# EAGLE design RPi-ILDA-DAC (EAGLE 6.4)
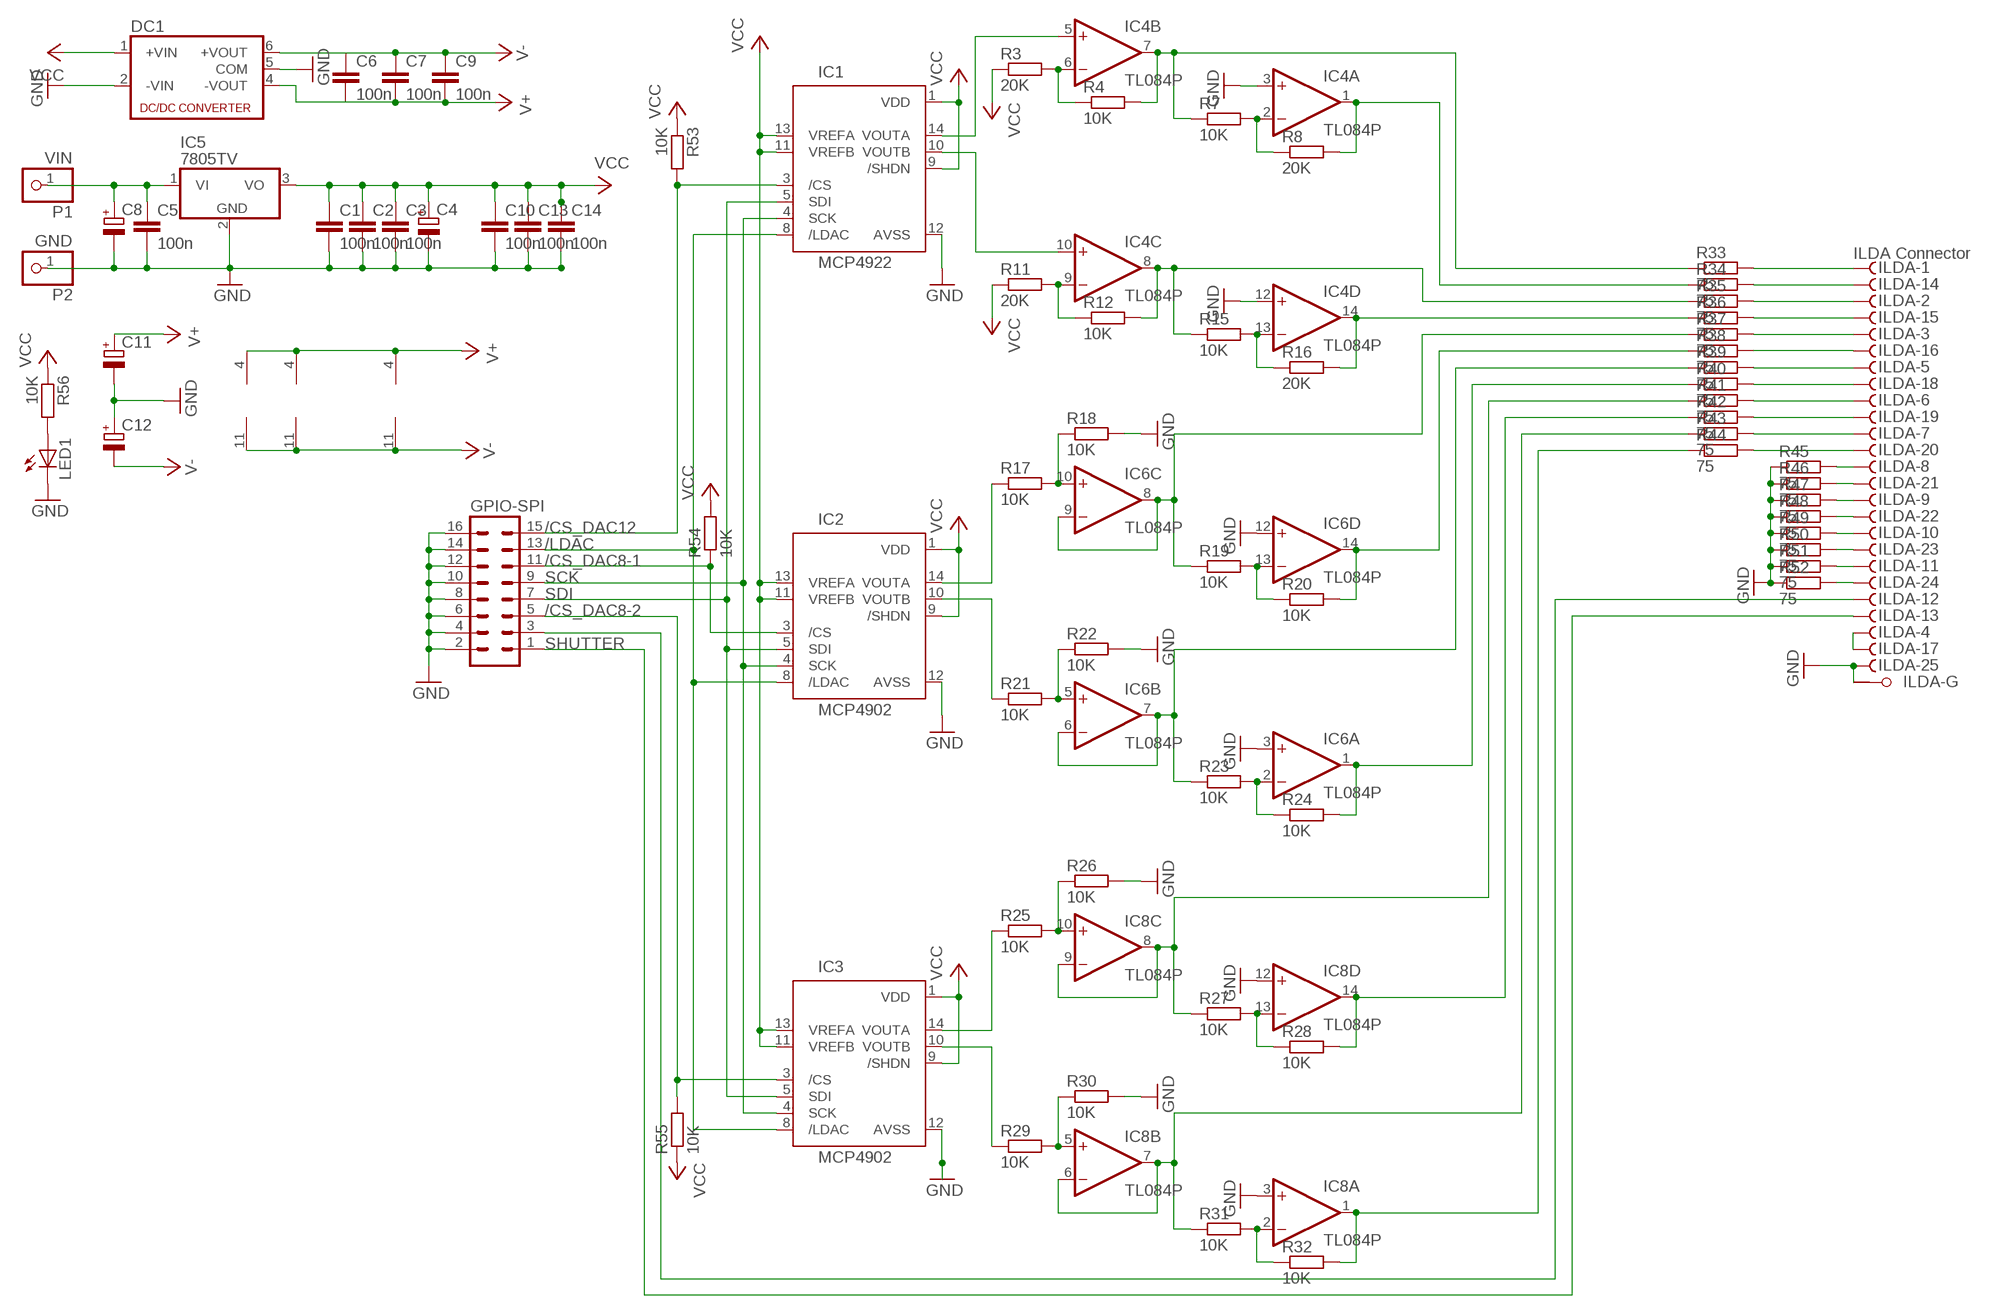
[diagram p0: schematic, sheet 1]

## Parts
C1  100n  C-EU050-024X044  [C050-024X044]
C2  100n  C-EU050-024X044  [C050-024X044]
C3  100n  C-EU050-024X044  [C050-024X044]
C4  CPOL-EUE5-6  [E5-6]
C5  100n  C-EU050-024X044  [C050-024X044]
C6  100n  C-EU050-024X044  [C050-024X044]
C7  100n  C-EU050-024X044  [C050-024X044]
C8  CPOL-EUE5-6  [E5-6]
C9  100n  C-EU050-024X044  [C050-024X044]
C10  100n  C-EU050-024X044  [C050-024X044]
C11  CPOL-EUE5-6  [E5-6]
C12  CPOL-EUE5-6  [E5-6]
C13  100n  C-EU050-024X044  [C050-024X044]
C14  100n  C-EU050-024X044  [C050-024X044]
DC1  NMA  [NMA]
GPIO-SPI  MA08-2  [MA08-2]
IC1  MCP4922  [DIL14]
IC2  MCP4902  MCP4922  [DIL14]
IC3  MCP4902  MCP4922  [DIL14]
IC4  TL084P  [DIL14]
IC5  7805TV  [TO220V]
IC6  TL084P  [DIL14]
IC8  TL084P  [DIL14]
ILDA  ILDA Connector  F25HPS  [F25HP]
LED1  LED3MM  [LED3MM]
P1  VIN  PINHD-1X1  [1X01]
P2  GND  PINHD-1X1  [1X01]
R3  20K  R-EU_0204/2V  [0204V]
R4  10K  R-EU_0204/2V  [0204V]
R7  10K  R-EU_0204/2V  [0204V]
R8  20K  R-EU_0204/2V  [0204V]
R11  20K  R-EU_0204/2V  [0204V]
R12  10K  R-EU_0204/2V  [0204V]
R15  10K  R-EU_0204/2V  [0204V]
R16  20K  R-EU_0204/2V  [0204V]
R17  10K  R-EU_0204/5  [0204/5]
R18  10K  R-EU_0204/2V  [0204V]
R19  10K  R-EU_0204/2V  [0204V]
R20  10K  R-EU_0204/2V  [0204V]
R21  10K  R-EU_0204/5  [0204/5]
R22  10K  R-EU_0204/2V  [0204V]
R23  10K  R-EU_0204/2V  [0204V]
R24  10K  R-EU_0204/2V  [0204V]
R25  10K  R-EU_0204/5  [0204/5]
R26  10K  R-EU_0204/2V  [0204V]
R27  10K  R-EU_0204/2V  [0204V]
R28  10K  R-EU_0204/2V  [0204V]
R29  10K  R-EU_0204/5  [0204/5]
R30  10K  R-EU_0204/2V  [0204V]
R31  10K  R-EU_0204/2V  [0204V]
R32  10K  R-EU_0204/2V  [0204V]
R33  75  R-EU_0204/7  [0204/7]
R34  75  R-EU_0204/7  [0204/7]
R35  75  R-EU_0204/7  [0204/7]
R36  75  R-EU_0204/7  [0204/7]
R37  75  R-EU_0204/7  [0204/7]
R38  75  R-EU_0204/7  [0204/7]
R39  75  R-EU_0204/7  [0204/7]
R40  75  R-EU_0204/7  [0204/7]
R41  75  R-EU_0204/7  [0204/7]
R42  75  R-EU_0204/7  [0204/7]
R43  75  R-EU_0204/7  [0204/7]
R44  75  R-EU_0204/7  [0204/7]
R45  75  R-EU_0204/2V  [0204V]
R46  75  R-EU_0204/2V  [0204V]
R47  75  R-EU_0204/2V  [0204V]
R48  75  R-EU_0204/2V  [0204V]
R49  75  R-EU_0204/2V  [0204V]
R50  75  R-EU_0204/2V  [0204V]
R51  75  R-EU_0204/2V  [0204V]
R52  75  R-EU_0204/2V  [0204V]
R53  10K  R-EU_0204/2V  [0204V]
R54  10K  R-EU_0204/2V  [0204V]
R55  10K  R-EU_0204/2V  [0204V]
R56  10K  R-EU_0204/7  [0204/7]

## Nets
/CS_DAC8-1: GPIO-SPI.11 IC2.3(/CS) R54.1
/CS_DAC8-2: GPIO-SPI.5 IC3.3(/CS) R55.2
/CS_DAC12: GPIO-SPI.15 IC1.3(/CS) R53.2
/LDAC: GPIO-SPI.13 IC1.8(/LDAC) IC2.8(/LDAC) IC3.8(/LDAC)
GND: C1.2 C2.2 C3.2 C4.- C5.2 C8.- C10.2 C11.- C12.+ C13.2 C14.2 DC1.2(-VIN) DC1.5(COM) GPIO-SPI.2 GPIO-SPI.4 GPIO-SPI.6 GPIO-SPI.8 GPIO-SPI.10 GPIO-SPI.12 GPIO-SPI.14 GPIO-SPI.16 IC1.12(AVSS) IC2.12(AVSS) IC3.12(AVSS) IC4.3(A:+IN) IC4.12(D:+IN) IC5.2(GND) IC6.3(A:+IN) IC6.12(D:+IN) IC8.3(A:+IN) IC8.12(D:+IN) ILDA.25(-25:F) ILDA.G1(-G:G1) LED1.K(C) P2.1 R18.2 R22.2 R26.2 R30.2 R45.1 R46.1 R47.1 R48.1 R49.1 R50.1 R51.1 R52.1
N$1: LED1.A R56.2
N$2: ILDA.3(-3:F) R37.2
N$3: IC4.7(B:OUT) R4.2 R7.1 R33.1
N$4: GPIO-SPI.3 ILDA.12(-12:F)
N$5: IC4.13(D:-IN) R15.2 R16.1
N$6: IC3.14(VOUTA) R25.1
N$7: IC6.1(A:OUT) R24.2 R40.1
N$8: IC6.2(A:-IN) R23.2 R24.1
N$9: IC6.5(B:+IN) R21.2 R22.1
N$10: ILDA.4(-4:F) ILDA.17(-17:F)
N$11: IC6.6(B:-IN) IC6.7(B:OUT) R23.1 R39.1
N$12: C5.1 C8.+ IC5.1(VI) P1.1
N$15: ILDA.5(-5:F) R39.2
N$16: IC1.14(VOUTA) IC4.5(B:+IN)
N$17: IC1.10(VOUTB) IC4.10(C:+IN)
N$18: ILDA.18(-18:F) R40.2
N$20: IC6.14(D:OUT) R20.2 R38.1
N$21: IC4.2(A:-IN) R7.2 R8.1
N$22: IC6.13(D:-IN) R19.2 R20.1
N$23: IC8.14(D:OUT) R28.2 R42.1
N$24: IC6.10(C:+IN) R17.2 R18.1
N$25: IC6.8(C:OUT) IC6.9(C:-IN) R19.1 R37.1
N$27: IC8.13(D:-IN) R27.2 R28.1
N$28: IC8.10(C:+IN) R25.2 R26.1
N$30: IC8.8(C:OUT) IC8.9(C:-IN) R27.1 R41.1
N$33: ILDA.8(-8:F) R45.2
N$34: ILDA.6(-6:F) R41.2
N$35: ILDA.16(-16:F) R38.2
N$37: IC4.14(D:OUT) R16.2 R36.1
N$38: ILDA.19(-19:F) R42.2
N$40: IC8.1(A:OUT) R32.2 R44.1
N$41: IC8.2(A:-IN) R31.2 R32.1
N$42: IC8.5(B:+IN) R29.2 R30.1
N$44: IC8.6(B:-IN) IC8.7(B:OUT) R31.1 R43.1
N$45: IC3.10(VOUTB) R29.1
N$47: IC4.1(A:OUT) R8.2 R34.1
N$49: IC4.8(C:OUT) R12.2 R15.1 R35.1
N$50: IC4.6(B:-IN) R3.2 R4.1
N$51: IC4.9(C:-IN) R11.2 R12.1
N$52: ILDA.7(-7:F) R43.2
N$53: ILDA.20(-20:F) R44.2
N$54: ILDA.21(-21:F) R46.2
N$55: ILDA.9(-9:F) R47.2
N$56: ILDA.22(-22:F) R48.2
N$57: ILDA.10(-10:F) R49.2
N$58: ILDA.23(-23:F) R50.2
N$59: IC2.14(VOUTA) R17.1
N$60: ILDA.11(-11:F) R51.2
N$61: ILDA.24(-24:F) R52.2
N$62: IC2.10(VOUTB) R21.1
N$91: ILDA.1(-1:F) R33.2
N$92: ILDA.14(-14:F) R34.2
N$93: ILDA.15(-15:F) R36.2
N$94: ILDA.2(-2:F) R35.2
SCK: GPIO-SPI.9 IC1.4(SCK) IC2.4(SCK) IC3.4(SCK)
SDI: GPIO-SPI.7 IC1.5(SDI) IC2.5(SDI) IC3.5(SDI)
SHUTTER: GPIO-SPI.1 ILDA.13(-13:F)
V+: C6.2 C7.2 C9.2 C11.+ DC1.4(-VOUT) IC4.4(P:V+) IC6.4(P:V+) IC8.4(P:V+)
V-: C6.1 C7.1 C9.1 C12.- DC1.6(+VOUT) IC4.11(P:V-) IC6.11(P:V-) IC8.11(P:V-)
VCC: C1.1 C2.1 C3.1 C4.+ C10.1 C13.1 C14.1 DC1.1(+VIN) IC1.1(VDD) IC1.9(/SHDN) IC1.11(VREFB) IC1.13(VREFA) IC2.1(VDD) IC2.9(/SHDN) IC2.11(VREFB) IC2.13(VREFA) IC3.1(VDD) IC3.9(/SHDN) IC3.11(VREFB) IC3.13(VREFA) IC5.3(VO) R3.1 R11.1 R53.1 R54.2 R55.1 R56.1
Unconnected: ILDA.G2(-G:G2)

## Library data of the parts
C1-C3 C5-C7 C9 C10 C13 C14 = rcl:C-EU: CAPACITOR, European symbol
C4 C8 C11 C12 = rcl:CPOL-EU: POLARIZED CAPACITOR, European symbol
DC1 = dc-dc-converter:NMA: DC-DC CONVERTER; MF: C & D TECHNOLOGIES, INC; MPN: NMA0515SC; OC_FARNELL: 1021434; OC_NEWARK: 61K3064
GPIO-SPI = con-lstb:MA08-2: PIN HEADER; OC_FARNELL: unknown; OC_NEWARK: unknown
IC1-IC3 = Peripherals:MCP4922: 12-Bit DAC with SPI Interface
IC4 IC6 IC8 = linear:TL084: OP AMP
IC5 = linear:78*: Positive VOLTAGE REGULATOR Source: http://cache.national.com/ds/LM/LM78L05.pdf http://www.fairchildsemi.com/ds/LM/LM7805.pdf
ILDA = con-subd:F25HPS: SUB-D; OC_FARNELL: unknown; OC_NEWARK: unknown
LED1 = led:LED: LED OSRAM: - CHIPLED LG R971, LG N971, LY N971, LG Q971, LY Q971, LO R971, LY R971 LH N974, LH R974 LS Q976, LO Q976, LY Q976 LO Q996 - Hyper CHIPLED LW Q18S LB Q993, LB Q99A, LB R99A - SideLED LS A670, LO A670, LY A670, LG A670, LP A670 LB A673, LV A673, LT A673, LW A673 LH A674 LY A675 LS A676, LA A676, LO A676, LY A676, LW A676 LS A679, LY A679, LG A679 - Hyper Micro SIDELED® LS Y876, LA Y876, LO Y876, LY Y876 LT Y87S - SmartLED LW L88C, LW L88S LB L89C, LB L89S, LG L890 LS L89K, LO L89K, LY L89K LS L896, LA L896, LO L896, LY L896 - TOPLED LS T670, LO T670, LY T670, LG T670, LP T670 LSG T670, LSP T670, LSY T670, LOP T670, LYG T670 LG T671, LOG T671, LSG T671 LB T673, LV T673, LT T673, LW T673 LH T674 LS T676, LA T676, LO T676, LY T676, LB T676, LH T676, LSB T676, LW T676 LB T67C, LV T67C, LT T67C, LS T67K, LO T67K, LY T67K, LW E67C LS E67B, LA E67B, LO E67B, LY E67B, LB E67C, LV E67C, LT E67C LW T67C LS T679, LY T679, LG T679 LS T770, LO T770, LY T770, LG T770, LP T770 LB T773, LV T773, LT T773, LW T773 LH T774 LS E675, LA E675, LY E675, LS T675 LS T776, LA T776, LO T776, LY T776, LB T776 LHGB T686 LT T68C, LB T68C - Hyper Mini TOPLED® LB M676 - Mini TOPLED Santana® LG M470 LS M47K, LO M47K, LY M47K Source: http://www.osram.convergy.de LUXEON: - LUMILED® LXK2-PW12-R00, LXK2-PW12-S00, LXK2-PW14-U00, LXK2-PW14-V00 LXK2-PM12-R00, LXK2-PM12-S00, LXK2-PM14-U00 LXK2-PE12-Q00, LXK2-PE12-R00, LXK2-PE12-S00, LXK2-PE14-T00, LXK2-PE14-U00 LXK2-PB12-K00, LXK2-PB12-L00, LXK2-PB12-M00, LXK2-PB14-N00, LXK2-PB14-P00, LXK2-PB14-Q00 LXK2-PR12-L00, LXK2-PR12-M00, LXK2-PR14-Q00, LXK2-PR14-R00 LXK2-PD12-Q00, LXK2-PD12-R00, LXK2-PD12-S00 LXK2-PH12-R00, LXK2-PH12-S00 LXK2-PL12-P00, LXK2-PL12-Q00, LXK2-PL12-R00 Source: www.luxeon.com KINGBRIGHT: KA-3528ASYC Source: www.kingbright.com
P1 P2 = pinhead:PINHD-1X1: PIN HEADER
R3 R4 R7 R8 R11 R12 R15-R56 = resistor:R-EU_: RESISTOR, European symbol

## Board
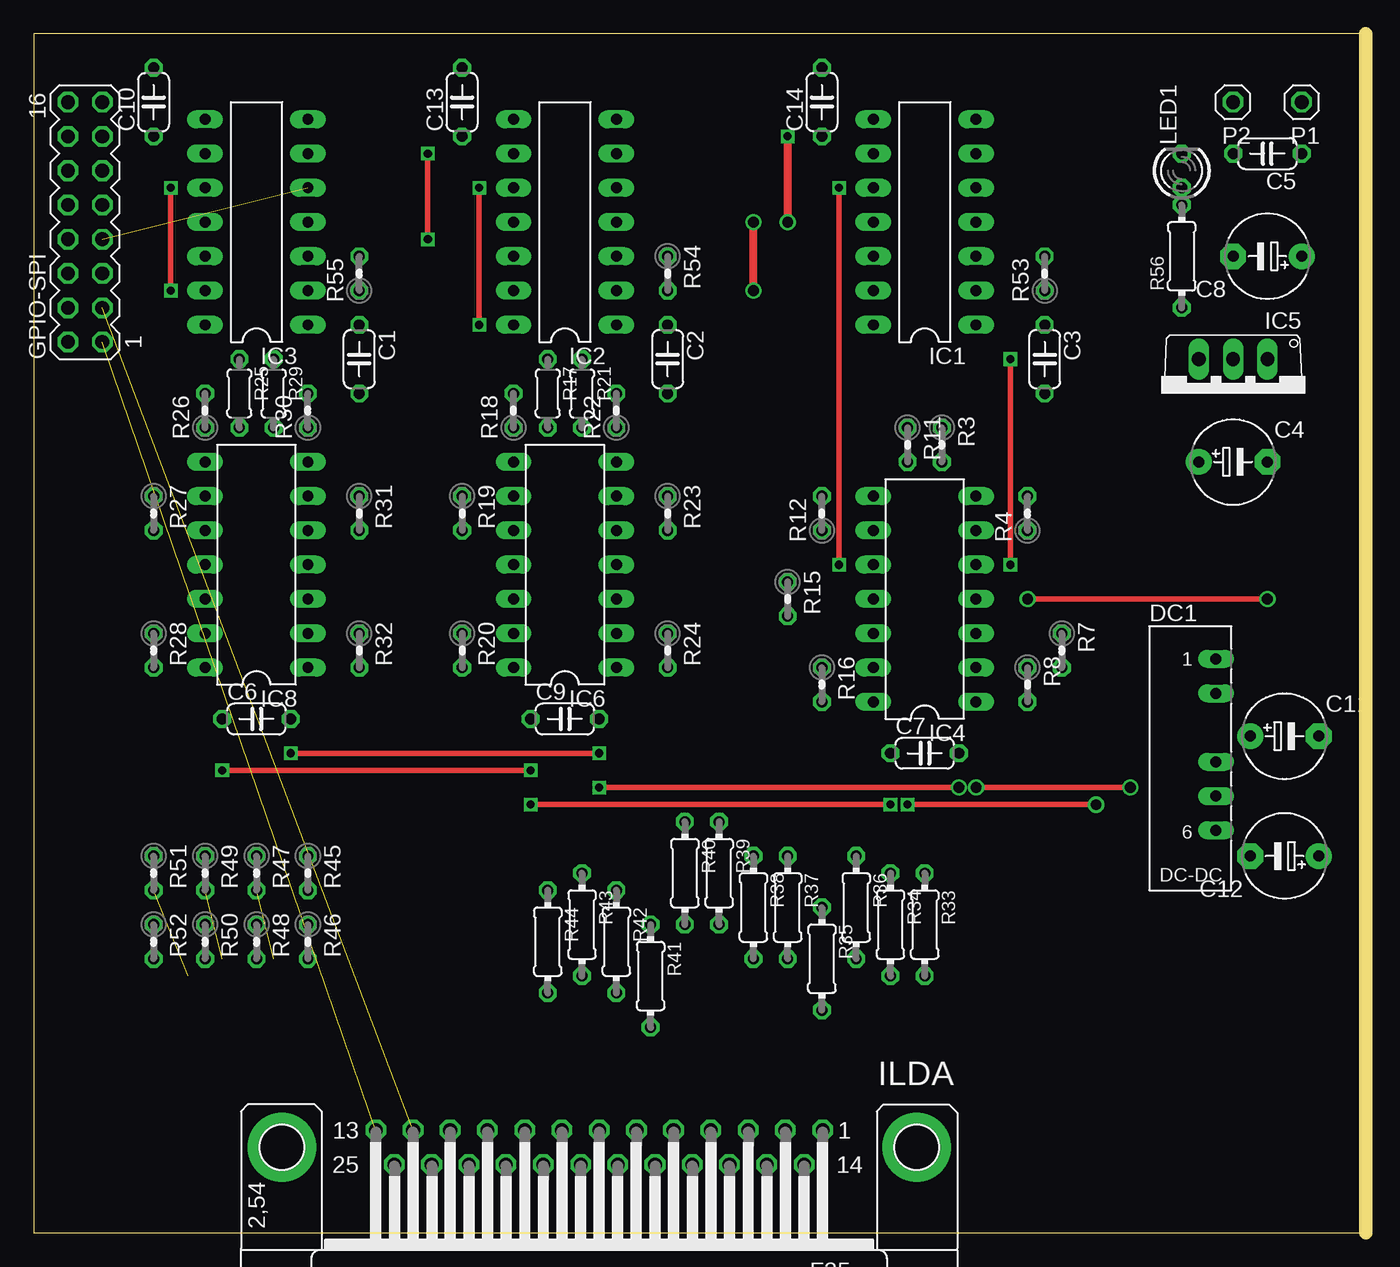
[diagram p1: board, top side]
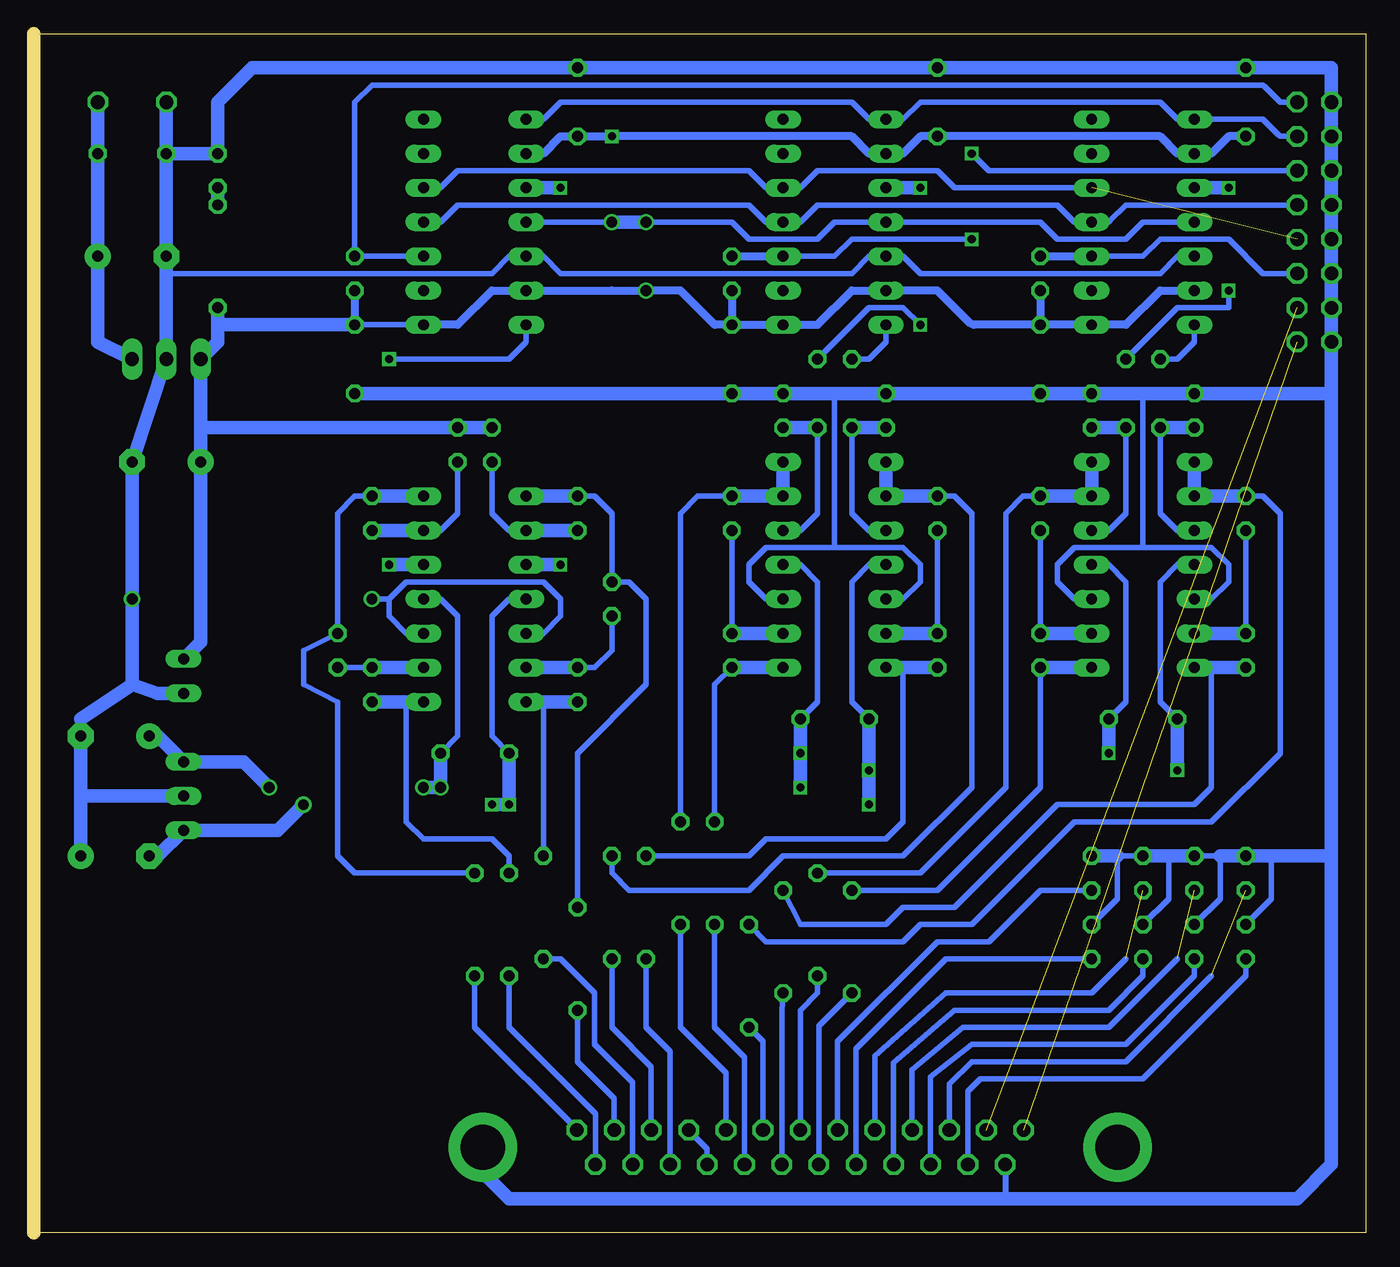
[diagram p2: board, bottom side, seen from below]

Size 98.73 x 88.89 mm. Coordinates in mm from the lower left corner, seen from the top.
Outline: 0,0 98.73,0 98.73,88.89 0,88.89 0,0
Copper layers (1*16): Top 0.035mm / dielectric 1.5mm / Bottom 0.035mm
Design rules "default": minimum track width 10mil, minimum drill 24mil, track to track 8mil, track to pad 8mil, pad to pad 8mil, via to via 8mil, smd to smd 8mil, copper to edge 40mil, drill to drill 8mil, minimum pad ring 10mil, minimum via ring 8mil, stop-mask expansion 4mil, vias tented up to drill 0mil, thermal gap 10mil

### Footprints (pad centres in the part's own frame; a part is rotated, then mirrored left to right if it is on the bottom)
C050-024X044 = drill 0.813 octagon: 1 -2.54,0; 2 2.54,0
E5-6 = drill 0.813 pad 1.905: + -2.54,0 | drill 0.813 pad 1.905 octagon: - 2.54,0
NMA = drill 0.813 long: 1 0,6.35; 2 0,3.81; 4 0,-1.27; 5 0,-3.81; 6 0,-6.35
MA08-2 = drill 1.016 octagon: 1 -8.89,-1.27; 2 -8.89,1.27; 3 -6.35,-1.27; 4 -6.35,1.27; 5 -3.81,-1.27; 6 -3.81,1.27; 7 -1.27,-1.27; 8 -1.27,1.27; 9 1.27,-1.27; 10 1.27,1.27; 11 3.81,-1.27; 12 3.81,1.27; 13 6.35,-1.27; 14 6.35,1.27; 15 8.89,-1.27; 16 8.89,1.27
DIL14 = drill 0.813 long: 1 -7.62,-3.81; 2 -5.08,-3.81; 3 -2.54,-3.81; 4 0,-3.81; 5 2.54,-3.81; 6 5.08,-3.81; 7 7.62,-3.81; 8 7.62,3.81; 9 5.08,3.81; 10 2.54,3.81; 11 0,3.81; 12 -2.54,3.81; 13 -5.08,3.81; 14 -7.62,3.81
TO220V = drill 1.016 long: 1 -2.54,-2.54; 2 0,-2.54; 3 2.54,-2.54
F25HP = drill 1.016 octagon: 1 -16.561,-1.27; 2 -13.792,-1.27; 3 -11.049,-1.27; 4 -8.28,-1.27; 5 -5.512,-1.27; 6 -2.769,-1.27; 7 0,-1.27; 8 2.769,-1.27; 9 5.512,-1.27; 10 8.28,-1.27; 11 11.049,-1.27; 12 13.792,-1.27; 13 16.561,-1.27; 14 -15.189,1.27; 15 -12.421,1.27; 16 -9.652,1.27; 17 -6.909,1.27; 18 -4.14,1.27; 19 -1.372,1.27; 20 1.372,1.27; 21 4.14,1.27; 22 6.909,1.27; 23 9.652,1.27; 24 12.421,1.27; 25 15.189,1.27 | drill 3.302 pad 5.08: G1 -23.52,0; G2 23.52,0
LED3MM = drill 0.813 octagon: A -1.27,0; K 1.27,0
1X01 = drill 1.016 octagon: 1 0,0
0204V = drill 0.813 octagon: 1 -1.27,0; 2 1.27,0
0204/5 = drill 0.813 octagon: 1 -2.54,0; 2 2.54,0
0204/7 = drill 0.813 octagon: 1 -3.81,0; 2 3.81,0

### Placement (x,y rotation side)
C1  24.13,64.77 270 top
C2  46.99,64.77 270 top
C3  74.93,64.77 270 top
C4  88.9,57.15 0 top
C5  91.44,80.01 180 top
C6  16.51,38.1 0 top
C7  66.04,35.56 0 top
C8  91.44,72.39 180 top
C9  39.37,38.1 0 top
C10  8.89,83.82 90 top
C11  92.71,36.83 0 top
C12  92.71,27.94 180 top
C13  31.75,83.82 90 top
C14  58.42,83.82 90 top
DC1  87.63,36.2 0 top
GPIO-SPI  3.81,74.93 90 top
IC1  66.04,74.93 90 top
IC2  39.37,74.93 90 top
IC3  16.51,74.93 90 top
IC4  66.04,46.99 90 top
IC5  88.9,62.23 180 top
IC6  39.37,49.53 90 top
IC8  16.51,49.53 90 top
ILDA  41.91,6.35 180 top
LED1  85.09,78.74 90 top
P1  93.98,83.82 180 top
P2  88.9,83.82 180 top
R3  67.31,58.42 270 top
R4  73.66,53.34 90 top
R7  76.2,43.18 270 top
R8  73.66,40.64 270 top
R11  64.77,58.42 270 top
R12  58.42,53.34 90 top
R15  55.88,46.99 270 top
R16  58.42,40.64 270 top
R17  38.1,62.23 270 top
R18  35.56,60.96 90 top
R19  31.75,53.34 270 top
R20  31.75,43.18 270 top
R21  40.64,62.23 270 top
R22  43.18,60.96 90 top
R23  46.99,53.34 270 top
R24  46.99,43.18 270 top
R25  15.24,62.23 270 top
R26  12.7,60.96 90 top
R27  8.89,53.34 270 top
R28  8.89,43.18 270 top
R29  17.78,62.23 270 top
R30  20.32,60.96 90 top
R31  24.13,53.34 270 top
R32  24.13,43.18 270 top
R33  66.04,22.86 270 top
R34  63.5,22.86 270 top
R35  58.42,20.32 270 top
R36  60.96,24.13 270 top
R37  55.88,24.13 270 top
R38  53.34,24.13 270 top
R39  50.8,26.67 270 top
R40  48.26,26.67 270 top
R41  45.72,19.05 270 top
R42  43.18,21.59 270 top
R43  40.64,22.86 270 top
R44  38.1,21.59 270 top
R45  20.32,26.67 270 top
R46  20.32,21.59 270 top
R47  16.51,26.67 270 top
R48  16.51,21.59 270 top
R49  12.7,26.67 270 top
R50  12.7,21.59 270 top
R51  8.89,26.67 270 top
R52  8.89,21.59 270 top
R53  74.93,71.12 90 top
R54  46.99,71.12 270 top
R55  24.13,71.12 90 top
R56  85.09,72.39 90 top

### Tracks (layer width: path | path; a pad name or v marks a point on that pad's centre or on a via)
/CS_DAC8-1  (via drill 0.6)
  Top 0.406: v29.21,73.66 v29.21,80.01
  Bottom 0.406: v29.21,80.01 27.94,78.74 GPIO-SPI.11 | IC2.3 39.37,72.39 38.1,73.66 v29.21,73.66
  Bottom 0.61: R54.1 IC2.3
/CS_DAC8-2
  Bottom 0.406: IC3.3 16.51,72.39 15.24,73.66 10.16,73.66 7.62,71.12 GPIO-SPI.5
  Bottom 0.61: R55.2 IC3.3
/CS_DAC12
  Bottom 0.406: 7.75,85.09 arc45 7.53,85 | 7.53,85 6.35,83.82 GPIO-SPI.15 | 7.75,85.09 73.66,85.09 74.93,83.82 R53.2 IC1.3 | 7.75,85.09 arc45 7.53,85
/LDAC
  Bottom 0.406: GPIO-SPI.13 6.22,81.28 arc45 6.44,81.37 7.62,82.55 IC3.8 13.97,82.55 15.24,83.82 33.02,83.82 34.29,82.55 IC2.8 36.83,82.55 38.1,83.82 59.69,83.82 60.96,82.55 IC1.8
GND  (via drill 0.8)
  Top 0.406: v73.66,46.99 v91.44,46.99
  Bottom 0.406: IC8.12 11.43,46.99 10.16,48.26 10.16,49.53 11.43,50.8 16.51,50.8 | IC8.3 21.59,46.99 22.86,48.26 22.86,49.53 21.59,50.8 16.51,50.8 | IC4.3 71.12,44.45 72.39,45.72 72.39,46.99 | IC4.12 60.96,44.45 59.69,45.72 59.69,46.99 60.96,48.26 71.12,48.26 72.39,46.99 | IC6.3 44.45,46.99 45.72,48.26 45.72,49.53 44.45,50.8 39.37,50.8 | IC6.12 34.29,46.99 33.02,48.26 33.02,49.53 34.29,50.8 39.37,50.8 | 39.37,50.8 39.37,62.23 | 16.51,50.8 16.51,62.23 | R47.1 18.41,27.94 18.41,24.77 R46.1 | R49.1 10.79,27.94 10.79,24.77 R50.1 | R48.1 14.61,24.77 14.61,27.94 | R52.1 6.98,24.77 6.98,27.94 | C5.2 88.9,71.12 64.77,71.12 63.5,72.39 IC1.12 60.96,72.39 59.69,71.12 38.1,71.12 36.83,72.39 IC2.12 34.29,72.39 33.02,71.12 15.24,71.12 13.97,72.39 IC3.12 | LED1.K 85.09,83.82 82.55,86.36 C10.2 | 94.61,32.38 95.25,33.02 | C11.- 95.25,38.1 | 72.39,46.99 v73.66,46.99 | 26.67,2.54 26.67,5.03 ILDA.25 26.72,2.59 26.67,2.54
  Bottom 1.016: C5.2 LED1.K 85.09,83.69 arc45 85,83.91 82.55,86.36 C14.2 C13.2 C10.2 2.54,86.36 GPIO-SPI.16 GPIO-SPI.14 GPIO-SPI.12 GPIO-SPI.10 GPIO-SPI.8 GPIO-SPI.6 GPIO-SPI.4 GPIO-SPI.2 2.54,62.23 | C5.2 P2.1 | C5.2 C8.- 88.9,71.12 IC5.2 C4.- v91.44,46.99 91.44,40.64 | R18.2 39.37,62.23 R22.2 C2.2 C3.2 | R30.2 C1.2 R18.2 | R30.2 16.51,62.23 R26.2 2.54,62.23 | R18.2 R30.2 | ILDA.G1 65.43,4.47 63.5,2.54 26.67,2.54 5.08,2.54 2.54,5.08 2.54,27.94 | 2.54,27.94 2.54,62.23 | R45.1 18.41,27.94 | R47.1 14.61,27.94 R49.1 | 10.79,27.94 R51.1 6.98,27.94 2.54,27.94 | C12.+ 95.25,33.02 C11.- | DC1.5 94.61,32.38 | 91.44,40.64 89.53,40 DC1.2 | 95.25,38.1 91.44,40.64
N$1
  Bottom 1.016: R56.2 LED1.A
N$2
  Bottom 0.406: ILDA.3 52.96,12.32 55.88,15.24 R37.2
N$3
  Bottom 0.406: R4.2 74.93,54.61 76.2,53.34 R7.1 78.74,43.18 78.74,40.64 76.2,39.37 76.2,27.94 74.93,26.67 R33.1
  Bottom 1.016: IC4.7 R4.2
N$4  (1 unrouted)
N$5
  Bottom 0.406: R16.1 57.15,41.91 55.88,43.18 R15.2
  Bottom 1.016: R16.1 IC4.13
N$6
  Bottom 0.406: IC3.14 12.7,66.04 13.97,64.77 R25.1
N$7
  Bottom 0.406: R40.1 48.26,40.64 R24.2
  Bottom 1.016: R24.2 IC6.1
N$8
  Bottom 0.406: R23.2 R24.1
  Bottom 1.016: IC6.2 R24.1
N$9
  Bottom 0.406: IC6.5 41.91,52.07 40.64,53.34 R21.2
  Bottom 1.016: R21.2 R22.1
N$10
  Bottom 0.406: ILDA.17 48.82,6.25 ILDA.4
N$11
  Bottom 0.406: R39.1 50.8,53.34 49.53,54.61 R23.1
  Bottom 1.016: IC6.7 IC6.6 R23.1
N$12
  Bottom 1.016: IC5.1 93.98,66.04 C8.+ C5.1 P1.1
N$15
  Bottom 0.406: ILDA.5 47.42,11.86 50.8,15.24 R39.2
N$16  (via drill 0.6)
  Top 0.406: v72.39,64.77 v72.39,49.53
  Bottom 0.406: IC1.14 62.23,66.17 arc45 62.32,65.95 63.5,64.77 v72.39,64.77
  Bottom 1.016: v72.39,49.53 IC4.5
N$17  (via drill 0.6)
  Top 0.406: v59.69,49.53 v59.69,77.47
  Bottom 1.016: IC4.10 v59.69,49.53 | v59.69,77.47 IC1.10
N$18
  Bottom 0.406: ILDA.18 46.05,13.03 48.26,15.24 R40.2
N$20
  Bottom 0.406: IC6.14 34.29,41.91 34.29,30.48 35.56,29.21 44.45,29.21 45.72,27.94 R38.1
  Bottom 1.016: 34.29,41.91 R20.2
N$21
  Bottom 0.406: R8.1 R7.2
  Bottom 1.016: IC4.2 R8.1
N$22
  Bottom 0.406: R20.1 R19.2
  Bottom 1.016: IC6.13 R20.1
N$23
  Bottom 0.406: IC8.14 11.43,41.91 11.43,33.02 12.7,31.75 22.86,31.75 30.48,24.13 34.29,24.13 35.56,22.86 41.91,22.86 R42.1
  Bottom 1.016: 11.43,41.91 R28.2
N$24
  Bottom 0.406: IC6.10 36.83,52.07 38.1,53.34 R17.2
  Bottom 1.016: R17.2 R18.1
N$25
  Bottom 0.406: R37.1 55.88,26.67 54.61,25.4 45.72,25.4 43.18,27.94 34.29,27.94 29.21,33.02 29.21,53.34 30.48,54.61 R19.1
  Bottom 1.016: IC6.8 IC6.9 R19.1
N$27
  Bottom 0.406: R28.1 R27.2
  Bottom 1.016: R28.1 IC8.13
N$28
  Bottom 0.406: R25.2 15.24,53.34 13.97,52.07 IC8.10
  Bottom 1.016: R25.2 R26.1
N$30
  Bottom 0.406: R27.1 7.62,54.61 6.35,53.34 6.35,35.56 11.43,30.48 21.59,30.48 29.21,22.86 33.02,22.86 34.29,21.59 44.45,21.59 R41.1
  Bottom 1.016: IC8.8 IC8.9 R27.1
N$33
  Bottom 0.406: ILDA.8 39.14,14.2 31.75,21.59 27.94,21.59 24.13,25.4 R45.2
N$34
  Bottom 0.406: ILDA.6 44.68,14.2 R41.2
N$35
  Bottom 0.406: ILDA.16 51.56,13.46 53.34,15.24 R38.2
N$37
  Bottom 0.406: IC4.14 60.96,39.37 R36.1
  Bottom 1.016: 60.96,39.37 R16.2
N$38
  Bottom 0.406: ILDA.19 43.28,16.41 R42.2
N$40
  Bottom 0.406: R44.1 31.75,25.4 24.13,33.02 R32.2
  Bottom 1.016: IC8.1 R32.2
N$41
  Bottom 0.406: R32.1 R31.2
  Bottom 1.016: R32.1 IC8.2
N$42
  Bottom 0.406: R29.2 17.78,53.34 19.05,52.07 IC8.5
  Bottom 1.016: R29.2 R30.1
N$44
  Bottom 0.406: R31.1 25.4,54.61 26.67,53.34 26.67,33.02 33.02,26.67 R43.1
  Bottom 1.016: IC8.7 IC8.6 R31.1
N$45  (via drill 0.6)
  Top 0.406: v10.16,69.85 v10.16,77.47
  Bottom 0.406: R29.1 13.97,68.58 10.16,68.58 v10.16,69.85
  Bottom 1.016: v10.16,77.47 IC3.10
N$47
  Bottom 0.406: IC4.1 71.12,39.37 71.12,30.48 69.85,29.21 64.77,29.21 63.5,27.94 R34.1
  Bottom 1.016: R8.2 71.12,39.37
N$49
  Bottom 0.406: 57.06,54.52 57.15,54.61 R12.2 57.28,54.61 arc45 57.06,54.52 | 57.06,54.52 55.88,53.34 R15.1 54.61,48.26 53.34,46.99 53.34,40.64 58.42,35.56 R35.1
  Bottom 1.016: IC4.8 R12.2
N$50
  Bottom 0.406: R3.2 67.31,53.34 68.58,52.07 IC4.6
  Bottom 1.016: R4.1 IC4.6
N$51
  Bottom 0.406: R11.2 64.77,53.34 63.5,52.07 IC4.9
  Bottom 1.016: R12.1 IC4.9
N$52
  Bottom 0.406: ILDA.7 41.91,16.51 40.64,17.78 R43.2
N$53
  Bottom 0.406: ILDA.20 40.54,15.34 R44.2
N$54
  Bottom 0.406: ILDA.21 37.77,13.67 31.11,20.32 R46.2
N$55  (1 unrouted)
  Bottom 0.406: ILDA.9 36.4,13.13 31.11,17.78 20.32,17.78 17.78,20.32
N$56
  Bottom 0.406: ILDA.22 35,12.62 30.48,16.51 19.05,16.51 16.51,19.05 R48.2
N$57  (1 unrouted)
  Bottom 0.406: ILDA.10 33.63,12.09 29.84,15.24 19.05,15.24 13.97,20.32
N$58
  Bottom 0.406: ILDA.23 32.26,11.56 29.21,13.97 17.78,13.97 12.7,19.05 R50.2
N$59
  Bottom 0.406: R17.1 36.83,64.77 35.56,66.04 IC2.14
N$60  (1 unrouted)
  Bottom 0.406: ILDA.11 30.86,11.05 29.21,12.7 17.78,12.7 11.43,19.05
N$61
  Bottom 0.406: ILDA.24 29.49,10.52 28.57,11.43 16.51,11.43 8.89,19.05 R52.2
N$62  (via drill 0.6)
  Top 0.406: v33.02,67.31 v33.02,77.47
  Bottom 0.406: R21.1 36.83,68.58 34.29,68.58 v33.02,67.31
  Bottom 1.016: v33.02,77.47 IC2.10
N$91
  Bottom 0.406: ILDA.1 58.47,7.67 66.04,15.24 R33.2
N$92
  Bottom 0.406: ILDA.14 57.1,8.84 63.5,15.24 R34.2
N$93
  Bottom 0.406: ILDA.15 54.33,11.15 57.15,13.97 57.15,17.78 59.69,20.32 R36.2
N$94
  Bottom 0.406: ILDA.2 55.7,9.98 58.42,12.7 R35.2
SCK
  Bottom 0.406: IC1.4 68.58,74.93 67.31,76.2 45.72,76.2 44.45,74.93 IC2.4 41.91,74.93 40.64,76.2 22.86,76.2 21.59,74.93 IC3.4 19.18,74.93 arc-45 18.96,75.02 17.78,76.2 GPIO-SPI.9
SDI  (1 unrouted)
  Bottom 0.406: IC1.5 68.58,77.47 67.31,78.74 45.72,78.74 44.45,77.47 IC2.5 41.91,77.47 40.64,78.74 31.75,78.74 30.48,77.47 IC3.5
SHUTTER  (1 unrouted)
V+  (via drill 0.6, 0.8)
  Top 0.406: v19.05,35.56 v41.91,35.56 | v81.28,33.02 v69.85,33.02 | v68.58,33.02 v41.91,33.02
  Bottom 0.406: IC8.4 19.05,49.53 17.78,48.26 17.78,39.37 C6.2 | IC6.4 41.91,49.53 40.64,48.26 40.64,39.37 C9.2 | IC4.4 68.58,46.99 67.31,45.72 67.31,36.83 C7.2 | C11.+ 89.53,36.83
  Bottom 1.016: C6.2 v19.05,35.56 | C9.2 v41.91,35.56 v41.91,33.02 | v69.85,33.02 v68.58,33.02 C7.2 | v81.28,33.02 83.19,34.92 DC1.4 89.53,36.83
V-  (via drill 0.6, 0.8)
  Top 0.406: v78.74,31.75 v64.77,31.75 | v63.5,31.75 v36.83,31.75 | v36.83,34.29 v13.97,34.29
  Bottom 0.406: IC8.11 13.97,49.53 15.24,48.26 15.24,39.37 C6.1 | C7.1 64.77,36.83 64.77,45.72 63.5,46.99 IC4.11 | IC6.11 36.83,49.53 38.1,48.26 38.1,39.37 C9.1 | C12.- 89.53,27.94
  Bottom 1.016: v64.77,31.75 v63.5,31.75 C7.1 | v36.83,31.75 v36.83,34.29 C9.1 | v13.97,34.29 C6.1 | v78.74,31.75 80.64,29.84 DC1.6 89.53,27.94
VCC  (via drill 0.6, 0.8)
  Top 0.61: v53.34,69.85 v53.34,74.93 | v55.88,81.28 v55.88,74.93
  Bottom 0.406: 34.29,80.01 IC2.9 36.83,80.01 | v53.34,74.93 46.99,74.93 45.72,73.66 40.64,73.66 39.37,74.93 IC2.11 24.13,74.93 22.86,73.66 17.78,73.66 16.51,74.93 IC3.11 | v55.88,74.93 IC1.11 | 29.08,67.31 arc45 29.3,67.4 | IC3.9 13.97,80.01 | IC1.1 76.2,67.31
  Bottom 0.61: C2.1 IC2.1 40.64,67.31 38.1,69.85 IC2.13 31.75,69.85 29.3,67.4 | IC3.13 15.24,69.85 17.78,67.31 IC3.1 C1.1 | R53.1 C3.1 | R55.1 C1.1 | C1.1 29.08,67.31 | IC1.1 67.31,67.31 64.77,69.85 IC1.13 v53.34,69.85 | 55.88,69.85 v53.34,69.85 | C10.1 10.16,81.28 11.43,80.01 IC3.9 | 13.97,80.01 15.24,81.28 C13.1 33.02,81.28 34.29,80.01 | 36.83,80.01 38.1,81.28 v55.88,81.28 C14.1 59.69,81.28 60.96,80.01 IC1.9 | R54.2 C2.1 | C2.1 48.26,67.31 50.8,69.85 v53.34,69.85
  Bottom 1.016: R56.1 85.09,67.31 | 85.09,67.31 85.09,66.04 IC5.3 86.36,59.69 | 86.36,59.69 C4.+ 86.36,43.81 DC1.1 | R11.1 R3.1 86.36,59.69 | C3.1 76.2,67.31 85.09,67.31 | v55.88,74.93 v53.34,74.93